# EAGLE design indicator-4x3-chain-v2 (EAGLE 7.7.0)
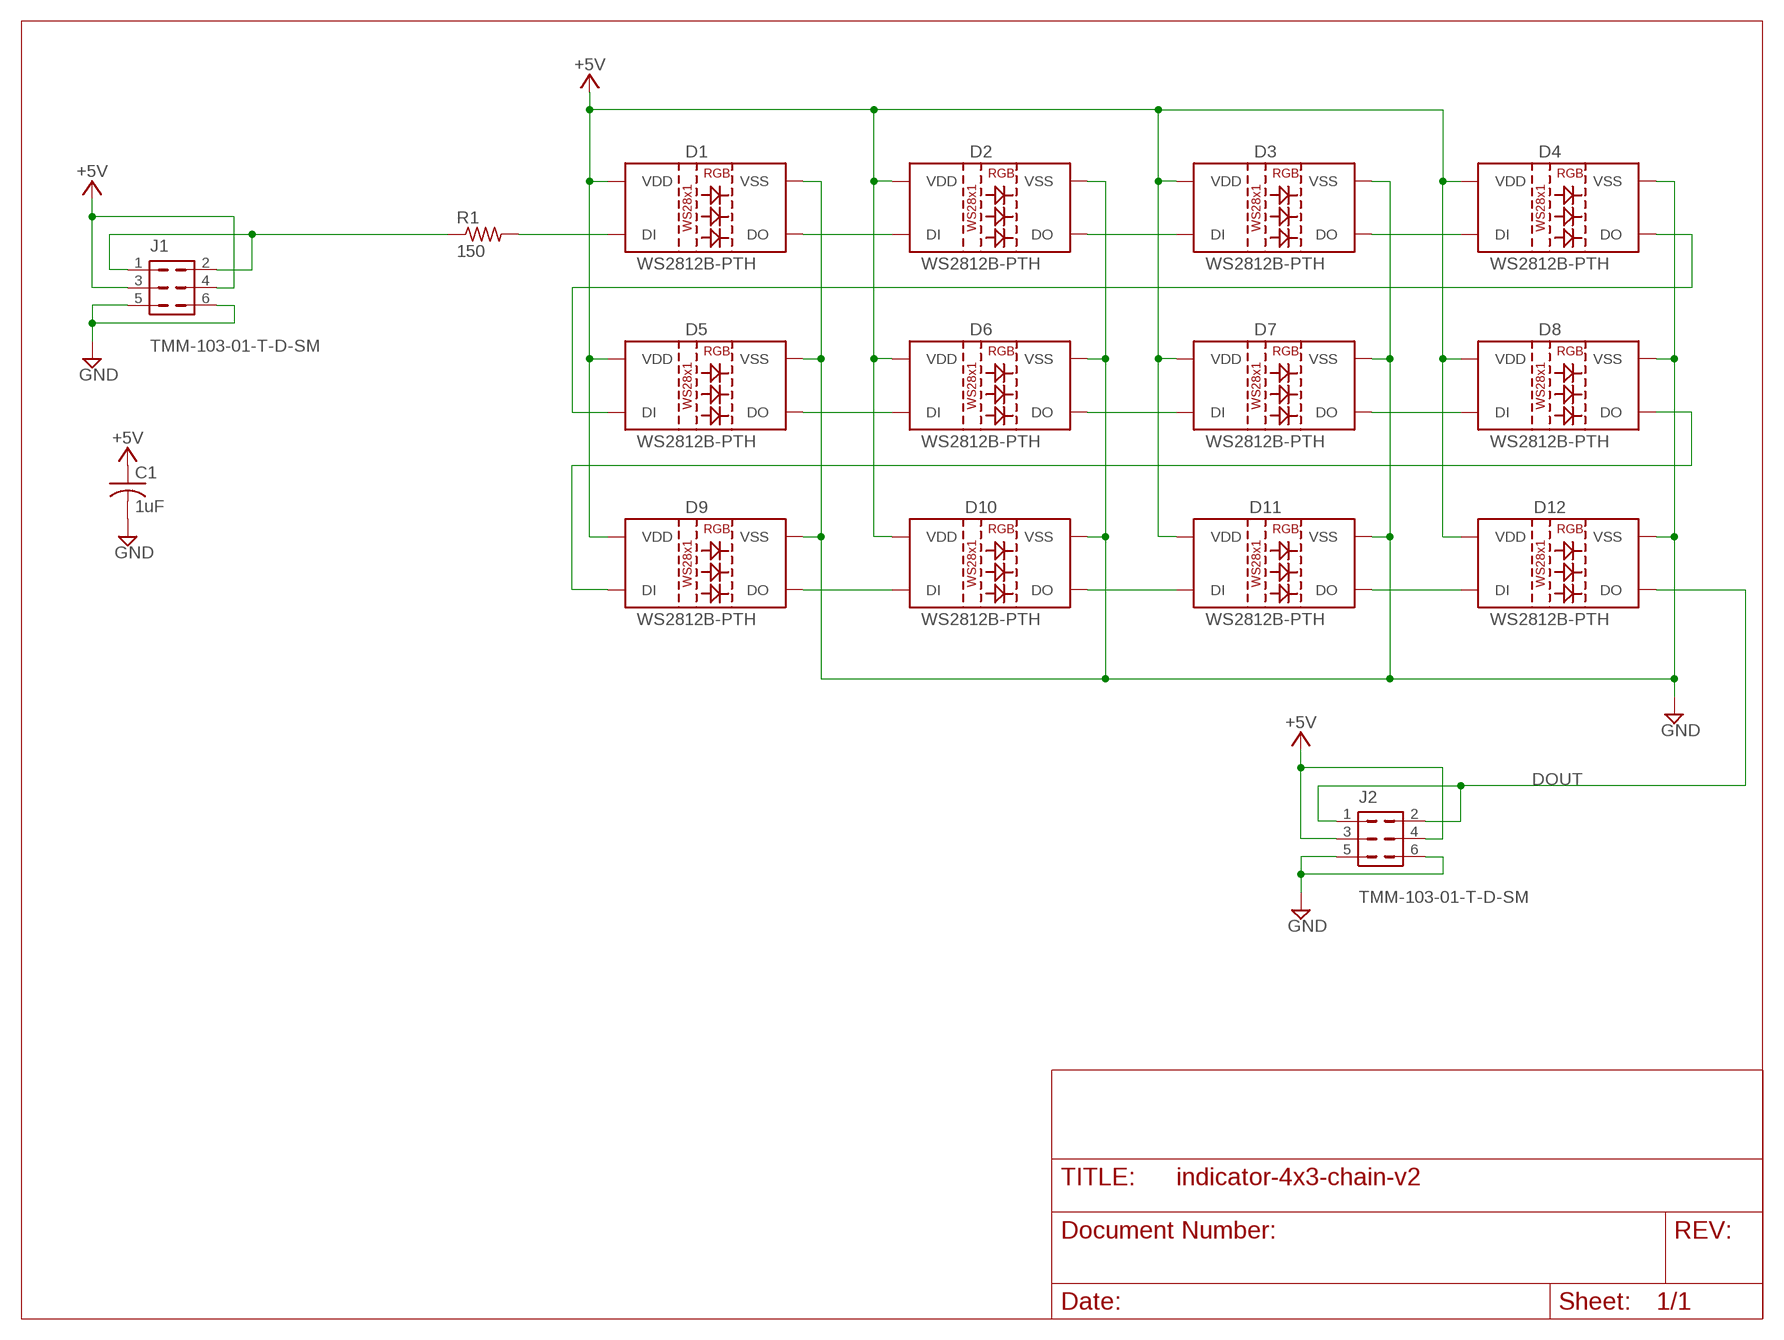
[diagram p0: schematic, sheet 1]

## Parts
C1  1uF  C-USC0603K  [C0603K]
D1  WS2812B-PTH  [WS2812B-PTH-KIT]
D2  WS2812B-PTH  [WS2812B-PTH-KIT]
D3  WS2812B-PTH  [WS2812B-PTH-KIT]
D4  WS2812B-PTH  [WS2812B-PTH-KIT]
D5  WS2812B-PTH  [WS2812B-PTH-KIT]
D6  WS2812B-PTH  [WS2812B-PTH-KIT]
D7  WS2812B-PTH  [WS2812B-PTH-KIT]
D8  WS2812B-PTH  [WS2812B-PTH-KIT]
D9  WS2812B-PTH  [WS2812B-PTH-KIT]
D10  WS2812B-PTH  [WS2812B-PTH-KIT]
D11  WS2812B-PTH  [WS2812B-PTH-KIT]
D12  WS2812B-PTH  [WS2812B-PTH-KIT]
J1  TMM-103-01-T-D-SM  [2MM-SMD-HEADER-2X3]
J2  TMM-103-01-T-D-SM  [2MM-SMD-HEADER-2X3]
R1  150  R-US_R0603  [R0603]

## Nets
+5V: C1.1 D1.2(VDD) D2.2(VDD) D3.2(VDD) D4.2(VDD) D5.2(VDD) D6.2(VDD) D7.2(VDD) D8.2(VDD) D9.2(VDD) D10.2(VDD) D11.2(VDD) D12.2(VDD) J1.3 J1.4 J2.3 J2.4
DIN: J1.1 J1.2 R1.1
DOUT: D12.4(DO) J2.1 J2.2
GND: C1.2 D1.3(VSS) D2.3(VSS) D3.3(VSS) D4.3(VSS) D5.3(VSS) D6.3(VSS) D7.3(VSS) D8.3(VSS) D9.3(VSS) D10.3(VSS) D11.3(VSS) D12.3(VSS) J1.5 J1.6 J2.5 J2.6
N$2: D5.4(DO) D6.1(DI)
N$3: D6.4(DO) D7.1(DI)
N$4: D1.4(DO) D2.1(DI)
N$5: D2.4(DO) D3.1(DI)
N$6: D3.4(DO) D4.1(DI)
N$7: D7.4(DO) D8.1(DI)
N$8: D4.4(DO) D5.1(DI)
N$9: D9.4(DO) D10.1(DI)
N$10: D10.4(DO) D11.1(DI)
N$11: D11.4(DO) D12.1(DI)
N$12: D1.1(DI) R1.2
N$15: D8.4(DO) D9.1(DI)

## Library data of the parts
C1 = rcl:C-US: CAPACITOR, American symbol
D1-D12 = SparkFun-LED:WS2812B-PTH: WS2812B PTH addressable RGB LED 5mm PTH LED with built-in controller IC. Color: Red/Green/Blue mC Rating: RGB: 390, 660, 180 mcd Forward Voltage: RGB: 2.0, 3.0, 3.0 V SparkFun Products: LED - RGB Addressable, PTH, 5mm Diffused (5 Pack) <https://www.sparkfun.com/products/12986> LED - RGB Addressable, PTH, 5mm Clear (5 Pack) <https://www.sparkfun.com/products/12999> Datasheet referenced for footprint: WS2812B-PTH <https://cdn.sparkfun.com/datasheets/Components/LED/COM-12877.pdf>
J1 J2 = GlenPartsLibrary:TMM-103-01-T-D-SM
R1 = rcl:R-US_: RESISTOR, American symbol

## Board
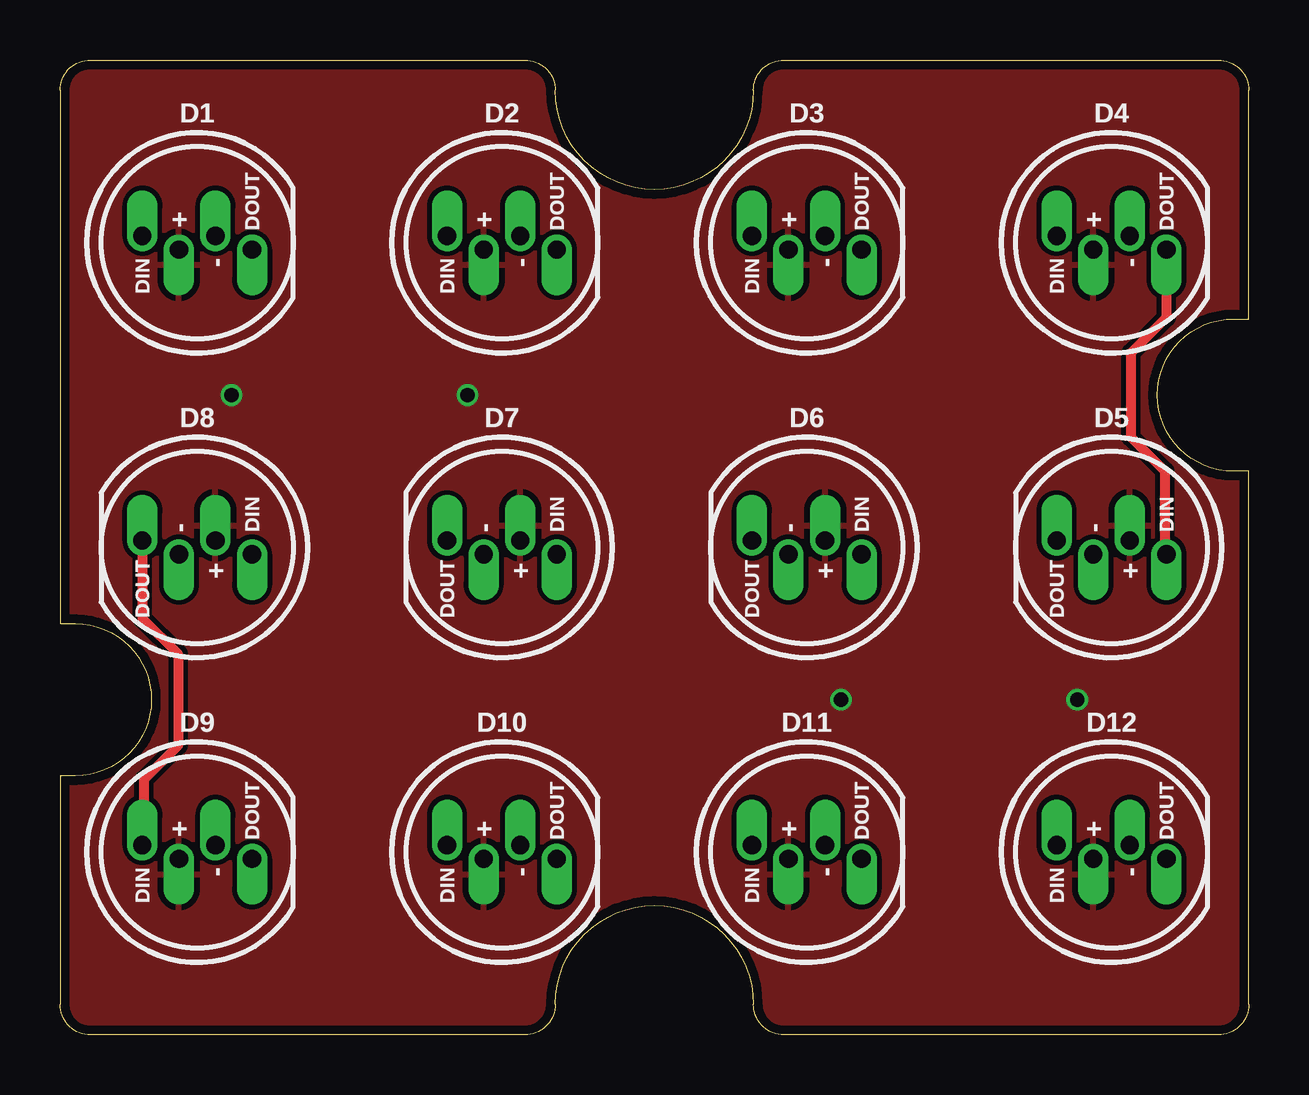
[diagram p1: board, top side]
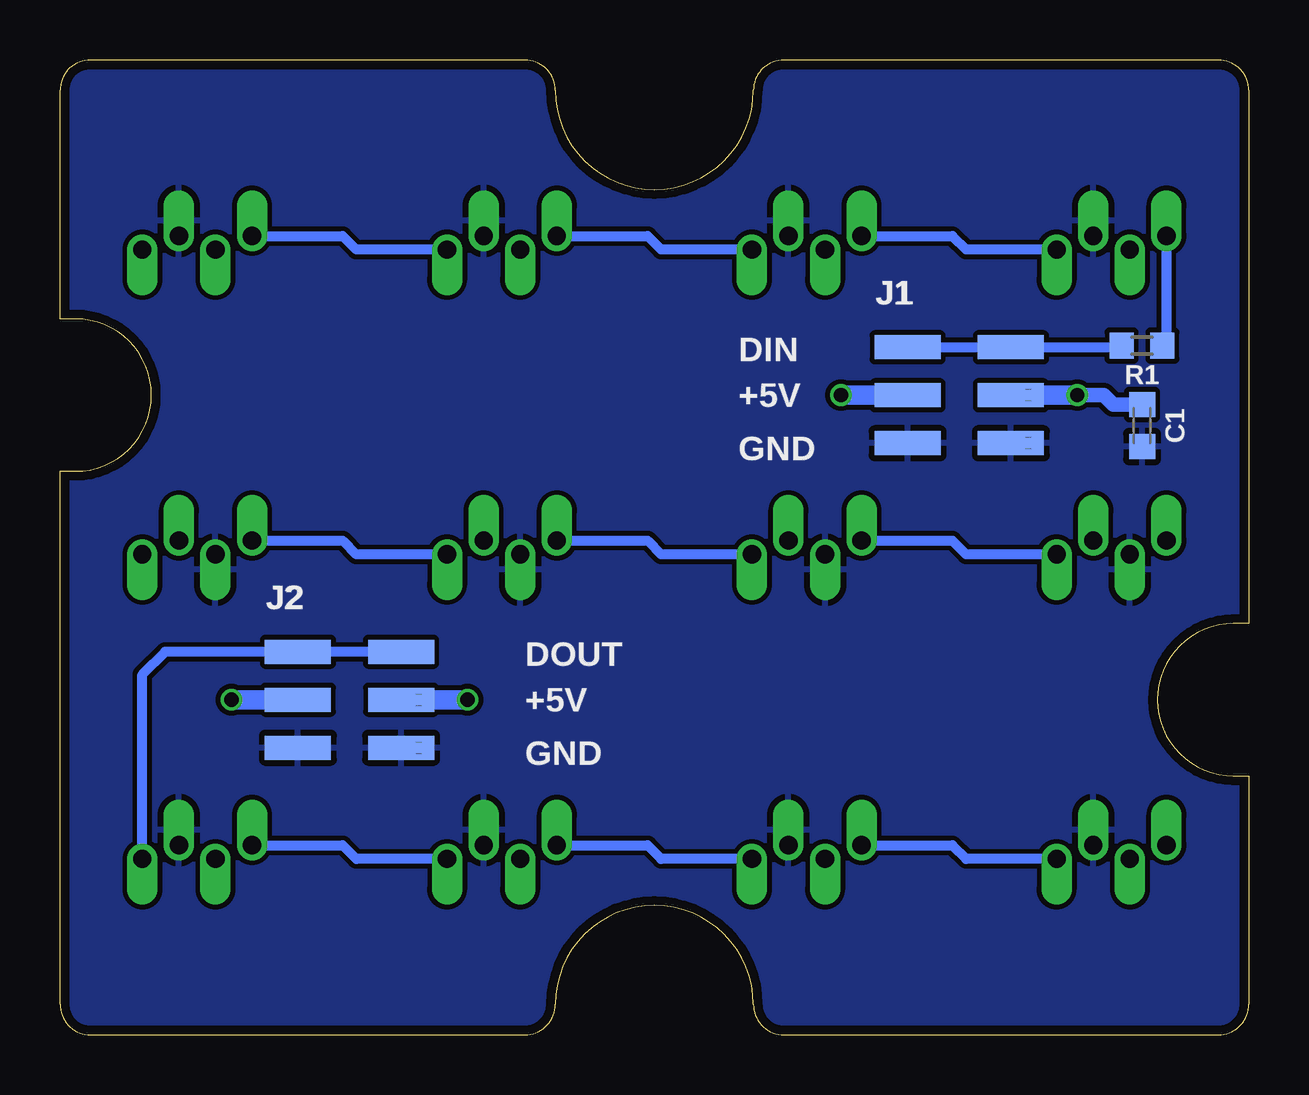
[diagram p2: board, bottom side, seen from below]

Size 49.53 x 40.64 mm. Coordinates in mm from the lower left corner, seen from the top.
Outline: 49.53,1.27 49.53,23.5 48.9,23.5 arc-180 48.9,29.84 49.53,29.84 49.53,39.37 arc90 48.26,40.64 30.16,40.64 arc90 28.89,39.37 arc-180 20.64,39.37 arc90 19.37,40.64 1.27,40.64 arc90 0,39.37 0,17.14 0.64,17.14 arc-180 0.64,10.79 0,10.79 0,1.27 arc90 1.27,0 19.37,0 arc90 20.64,1.27 arc-180 28.89,1.27 arc90 30.16,0 48.26,0 arc90 49.53,1.27
Copper layers (1*16): Top 0.035559375mm / dielectric 1.6mm / Bottom 0.035559375mm
Design rules "oshpark-2layer-2018": minimum track width 6mil, minimum drill 10mil, track to track 6mil, track to pad 6mil, pad to pad 6mil, via to via 6mil, smd to smd 6mil, copper to edge 15mil, drill to drill 6mil, minimum pad ring 5mil, minimum via ring 5mil, stop-mask expansion 2.5mil, vias tented up to drill 0mil, thermal gap 10mil

### Footprints (pad centres in the part's own frame; a part is rotated, then mirrored left to right if it is on the bottom)
C0603K = smd 1.05 x 1.08: 1 -0.875,0; 2 0.875,0
WS2812B-PTH-KIT = drill 0.762 pad 1.27 offset: 1 2.286,-0.286; 2 0.762,0.286; 3 -0.762,-0.286; 4 -2.286,0.286
2MM-SMD-HEADER-2X3 = smd 1 x 2.75: 1 -2,-2.15; 2 -2,2.15; 3 0,-2.15; 4 0,2.15; 5 2,-2.15; 6 2,2.15
R0603 = smd 1 x 1.1: 1 -0.85,0; 2 0.85,0

### Placement (x,y rotation side)
C1  4.45,25.4 270 bottom
D1  5.72,33.02 180 top
D2  18.41,33.02 180 top
D3  31.11,33.02 180 top
D4  43.82,33.02 180 top
D5  43.82,20.32 0 top
D6  31.11,20.32 0 top
D7  18.41,20.32 0 top
D8  5.72,20.32 0 top
D9  5.72,7.62 180 top
D10  18.41,7.62 180 top
D11  31.11,7.62 180 top
D12  43.82,7.62 180 top
J1  12.07,26.67 270 bottom
J2  37.47,13.97 270 bottom
R1  4.45,28.73 0 bottom

### Tracks (layer width: path | path; a pad name or v marks a point on that pad's centre or on a via)
+5V  (via drill 0.6)
  Bottom 0.61: C1.1 5.64,26.27 6.03,26.67 v7.14,26.67
  Bottom 0.813: J1.4 v7.14,26.67 | J1.3 v16.99,26.67 | J2.3 v42.39,13.97 | J2.4 v32.54,13.97
  pour Top (isolate 0.203): 0,40.64 49.53,40.64 49.53,0 0,0
DIN
  Bottom 0.203: 5.52,28.67 R1.1
  Bottom 0.406: J1.1 J1.2 5.52,28.67
DOUT
  Bottom 0.406: J2.2 J2.1 45.15,15.97 46.1,15.02 D12.4
GND
  pour Bottom (isolate 0.203): 0,0 49.53,0 49.53,40.64 0,40.64
N$2
  Bottom 0.406: D6.1 37.18,20.03 37.75,20.61 D5.4
N$3
  Bottom 0.406: D7.1 24.48,20.03 25.05,20.61 D6.4
N$4
  Bottom 0.406: D1.4 11.78,32.73 12.35,33.31 D2.1
N$5
  Bottom 0.406: D2.4 24.48,32.73 25.05,33.31 D3.1
N$6
  Bottom 0.406: D3.4 37.18,32.73 37.75,33.31 D4.1
N$7
  Bottom 0.406: D8.1 11.78,20.03 12.35,20.61 D7.4
N$8
  Top 0.406: D4.4 46.1,29.91 44.61,28.42 44.61,24.92 46.04,23.5 46.04,20.1 D5.1
N$9
  Bottom 0.406: D9.4 11.78,7.33 12.35,7.91 D10.1
N$10
  Bottom 0.406: D10.4 24.48,7.33 25.05,7.91 D11.1
N$11
  Bottom 0.406: D11.4 37.18,7.33 37.75,7.91 D12.1
N$12
  Bottom 0.203: 3.43,29.06 R1.2
  Bottom 0.406: D1.1 3.43,29.06
N$15
  Top 0.406: D8.4 3.43,17.37 4.92,15.88 4.92,12.06 3.49,10.64 3.49,7.97 D9.1

### Text on the board
_tsilk: D1 | D2 | D3 | D4 | + | DOUT | + | DOUT | + | DOUT | + | DOUT | DIN | - | DIN | - | DIN | - | DIN | - | D8 | D7 | D6 | D5 | - | DIN | - | DIN | - | DIN | - | DIN | DOUT | + | DOUT | + | DOUT | + | DOUT | + | D9 | D10 | D11 | D12 | + | DOUT | + | DOUT | + | DOUT | + | DOUT | DIN | - | DIN | - | DIN | - | DIN | -
_bsilk: J1 | DIN | +5V | C1 | GND | J2 | DOUT | +5V | GND